# Altium schematic sheet AC6901Demo1.SchDoc
size A4; SheetNumber: 2; SheetTotal: 2
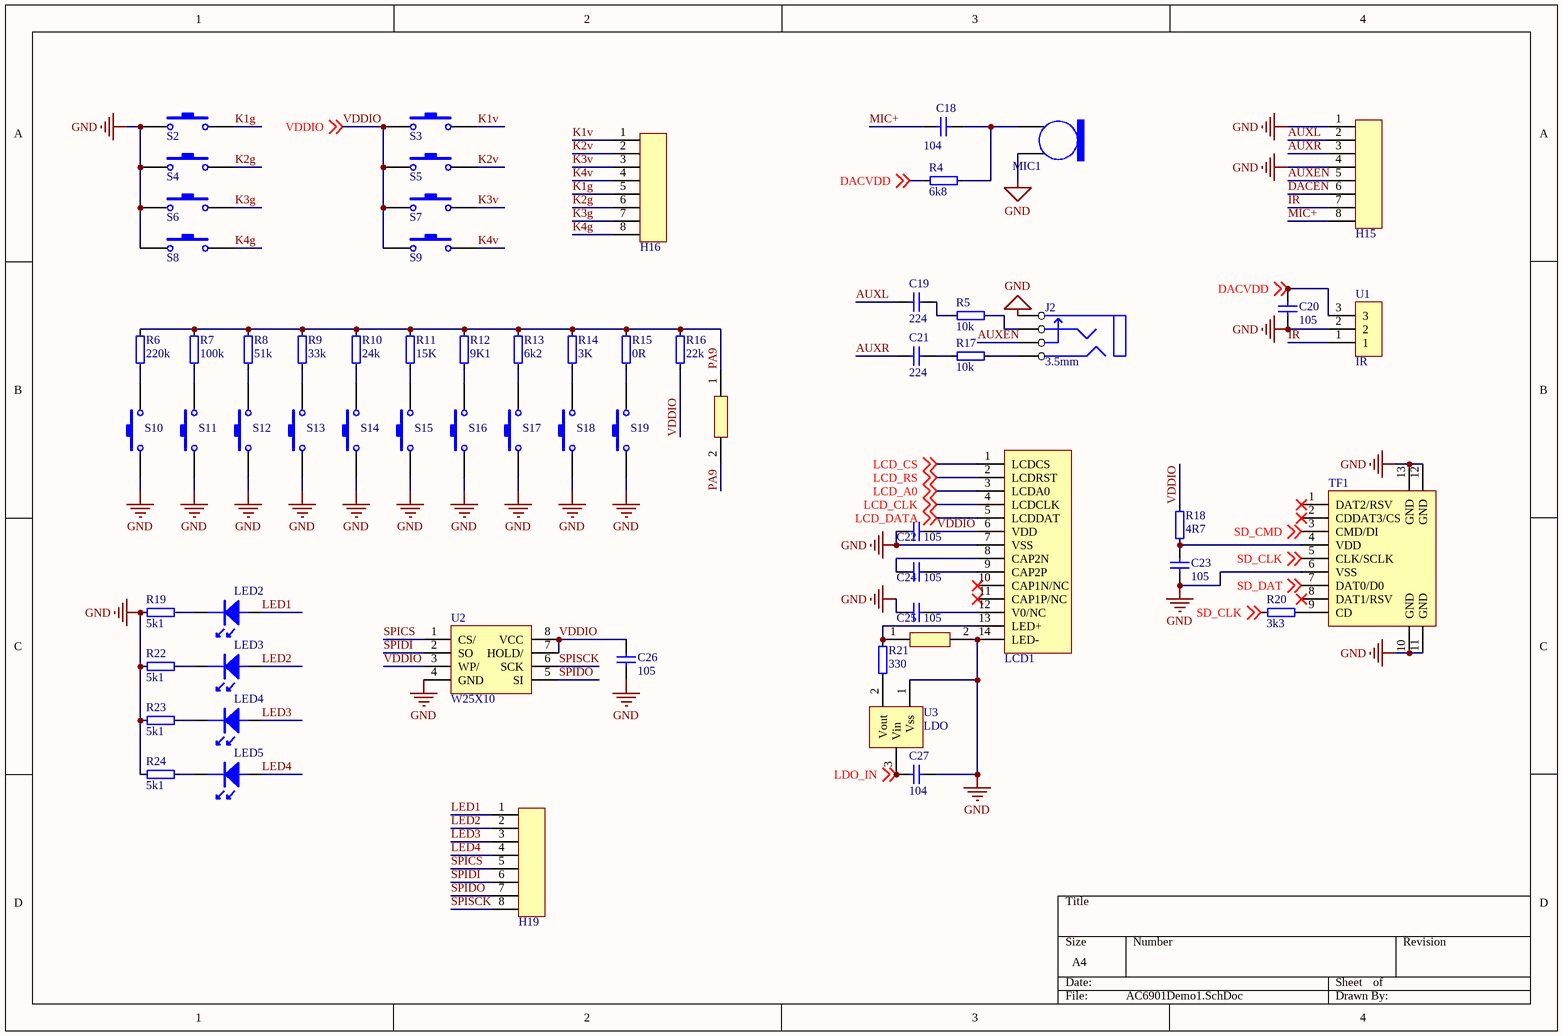
[diagram p0: AC6901Demo1.SchDoc]

## Parts
C18  104  [C 0805]
C19  224  [C 0805]
C20  105  [C 0805]
C21  224  [C 0805]
C22  105  [C 0805]
C23  105  [C 0805]
C24  105  [C 0805]
C25  105  [C 0805]
C26  105  [C 0805]
C27  104  [C 0805]
H15  HDR1X8  [HDR1X8]  (value not drawn)
H16  HDR1X8  [HDR1X8]  (value not drawn)
H17  HDR2X1  [HDR2X1]  (value not drawn)
H18  HDR2X1  [HDR2X1]  (value not drawn)
H19  HDR1X8  [HDR1X8]  (value not drawn)
J2  3.5mm  [AUX-3.5]
LCD1  LCD12864_ST7567  [FPC-SMD_P0.80-14P]  (value not drawn)
LED2  LED  [LED 0805B]  (value not drawn)
LED3  LED  [LED 0805B]  (value not drawn)
LED4  LED  [LED 0805B]  (value not drawn)
LED5  LED  [LED 0805B]  (value not drawn)
MIC1  MIC  [MIC]  (value not drawn)
R4  6k8  [R 0805]
R5  10k  [R 0805]
R6  220k  [R 0805]
R7  100k  [R 0805]
R8  51k  [R 0805]
R9  33k  [R 0805]
R10  24k  [R 0805]
R11  15K  [R 0805]
R12  9K1  [R 0805]
R13  6k2  [R 0805]
R14  3K  [R 0805]
R15  0R  [R 0805]
R16  22k  [R 0805]
R17  10k  [R 0805]
R18  4R7  [R 0805]
R19  5k1  [R 0805]
R20  3k3  [R 0805]
R21  330  [R 0805]
R22  5k1  [R 0805]
R23  5k1  [R 0805]
R24  5k1  [R 0805]
S2  SW-PB  [TSW SMD-3*6*2.5]  (value not drawn)
S3  SW-PB  [TSW SMD-3*6*2.5]  (value not drawn)
S4  SW-PB  [TSW SMD-3*6*2.5]  (value not drawn)
S5  SW-PB  [TSW SMD-3*6*2.5]  (value not drawn)
S6  SW-PB  [TSW SMD-3*6*2.5]  (value not drawn)
S7  SW-PB  [TSW SMD-3*6*2.5]  (value not drawn)
S8  SW-PB  [TSW SMD-3*6*2.5]  (value not drawn)
S9  SW-PB  [TSW SMD-3*6*2.5]  (value not drawn)
S10  SW-PB  [TSW SMD-3*6*2.5]  (value not drawn)
S11  SW-PB  [TSW SMD-3*6*2.5]  (value not drawn)
S12  SW-PB  [TSW SMD-3*6*2.5]  (value not drawn)
S13  SW-PB  [TSW SMD-3*6*2.5]  (value not drawn)
S14  SW-PB  [TSW SMD-3*6*2.5]  (value not drawn)
S15  SW-PB  [TSW SMD-3*6*2.5]  (value not drawn)
S16  SW-PB  [TSW SMD-3*6*2.5]  (value not drawn)
S17  SW-PB  [TSW SMD-3*6*2.5]  (value not drawn)
S18  SW-PB  [TSW SMD-3*6*2.5]  (value not drawn)
S19  SW-PB  [TSW SMD-3*6*2.5]  (value not drawn)
TF1  TF  [TF]  (value not drawn)
U1  IR  [IR]
U2  W25X10  [SOIC8]
U3  LDO  [SOT23-3L]

## Nets
GND: C20.1 C22.1 C23.1 C25.1 C26.1 C27.1 H15.1 H15.4 H18.2 J2.1 LCD1.7(VSS) LCD1.14(LED-) MIC1.2 R19.1 R22.1 R23.1 R24.1 S2.1 S4.1 S6.1 S8.1 S10.1 S11.1 S12.1 S13.1 S14.1 S15.1 S16.1 S17.1 S18.1 S19.1 TF1.6(VSS) TF1.10(GND) TF1.11(GND) TF1.12(GND) TF1.13(GND) U1.2 U2.4(GND) U3.1(Vss)
AUXEN: H15.5 J2.4
AUXL: C19.1 H15.2
AUXR: C21.1 H15.3
DACEN: H15.6
DACVDD: C20.2 R4.1 U1.3 ; off-sheet DACVDD
IR: H15.7 U1.1
K1g: H16.5 S2.2
K1v: H16.1 S3.2
K2g: H16.6 S4.2
K2v: H16.2 S5.2
K3g: H16.7 S6.2
K3v: H16.3 S7.2
K4g: H16.8 S8.2
K4v: H16.4 S9.2
LCD_A0: LCD1.3(LCDA0) ; off-sheet LCD_A0
LCD_CLK: LCD1.4(LCDCLK) ; off-sheet LCD_CLK
LCD_CS: LCD1.1(LCDCS) ; off-sheet LCD_CS
LCD_DATA: LCD1.5(LCDDAT) ; off-sheet LCD_DATA
LCD_RS: LCD1.2(LCDRST) ; off-sheet LCD_RS
LDO_IN: C27.2 U3.3(Vin) ; off-sheet LDO_IN
LED1: H19.1 LED2.1
LED2: H19.2 LED3.1
LED3: H19.3 LED4.1
LED4: H19.4 LED5.1
MIC+: C18.1 H15.8
PA9: H17.1 H17.2 R6.2 R7.2 R8.2 R9.2 R10.2 R11.2 R12.2 R13.2 R14.2 R15.2 R16.2
SD_CLK: R20.2 TF1.5(CLK/SCLK) ; off-sheet SD_CLK
SD_CMD: TF1.3(CMD/DI) ; off-sheet SD_CMD
SD_DAT: TF1.7(DAT0/D0) ; off-sheet SD_DAT
SPICS: H19.5 U2.1(CS/)
SPIDI: H19.6 U2.2(SO)
SPIDO: H19.7 U2.5(SI)
SPISCK: H19.8 U2.6(SCK)
VDDIO: C22.2 C26.2 LCD1.6(VDD) R16.1 R18.2 S3.1 S5.1 S7.1 S9.1 U2.3(WP/) U2.7(HOLD/) U2.8(VCC) ; off-sheet VDDIO
NetC18_2: C18.2 MIC1.1 R4.2
NetC19_2: C19.2 R5.1
NetC21_2: C21.2 R17.1
NetC23_2: C23.2 R18.1 TF1.4(VDD)
NetC24_1: C24.1 LCD1.8(CAP2N)
NetC24_2: C24.2 LCD1.9(CAP2P)
NetC25_2: C25.2 LCD1.12(V0/NC)
NetH18_1: H18.1 LCD1.13(LED+) R21.2
NetJ2_2: J2.2 R5.2
NetJ2_3: J2.3 R17.2
NetLED2_2: LED2.2 R19.2
NetLED3_2: LED3.2 R22.2
NetLED4_2: LED4.2 R23.2
NetLED5_2: LED5.2 R24.2
NetR6_1: R6.1 S10.2
NetR7_1: R7.1 S11.2
NetR8_1: R8.1 S12.2
NetR9_1: R9.1 S13.2
NetR10_1: R10.1 S14.2
NetR11_1: R11.1 S15.2
NetR12_1: R12.1 S16.2
NetR13_1: R13.1 S17.2
NetR14_1: R14.1 S18.2
NetR15_1: R15.1 S19.2
NetR20_1: R20.1 TF1.9(CD)
NetR21_1: R21.1 U3.2(Vout)

Not connected (* = marked no-connect by the designer): LCD1 10(CAP1N/NC)* 11(CAP1P/NC)*; TF1 1(DAT2/RSV)* 2(CDDAT3/CS)* 8(DAT1/RSV)*

## Library data of the parts
C18-C27 = CAP-MLCC
J2 = 立体声插头
R4-R24 = RES
S2-S19 = SW-PB: Published: 24-Mar-1999; LatestRevisionDate: 17-Jul-2002; LatestRevisionNote: Re-released for DXP Platform.; PackageReference: SPST-2; Publisher: Altium Limited